# EAGLE design module (EAGLE 9.0.1)
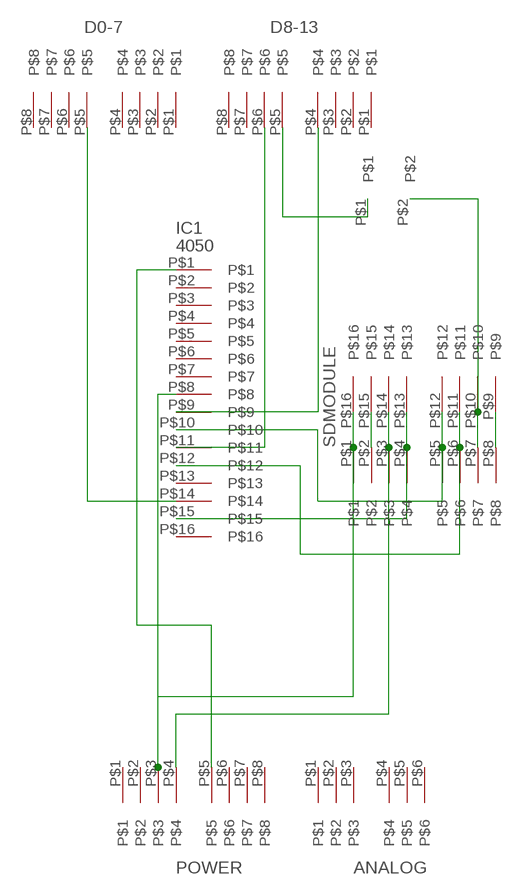
[diagram p0: schematic, sheet 1]

## Parts
ANALOG  PINPLUG6PINPLUG6  [PINPLUG6]
D0-7  PINPLUG8PINPLUG8  [PINPLUG8]
D8-13  PINPLUG8PINPLUG8  [PINPLUG8]
IC1  4050  ICMOUNT16ICMOUNT16  [ICMOUNT16]
POWER  PINPLUG8PINPLUG8  [PINPLUG8]
SDMODULE  PINPLUG8X2PINPLUG8X2  [PINPLUG8X2]
U$1  SHORTSHORT5  [SHORT5]

## Nets
N$1: IC1.P$1 POWER.P$5
N$4: D0-7.P$5 IC1.P$14
N$11: IC1.P$12 SDMODULE.P$6 SDMODULE.P$11
N$12: SDMODULE.P$7 SDMODULE.P$10 U$1.P$2
N$13: D8-13.P$4 IC1.P$9
N$19: SDMODULE.P$8 SDMODULE.P$9
N$20: IC1.P$8 POWER.P$3 SDMODULE.P$1 SDMODULE.P$16
N$22: D8-13.P$5 U$1.P$1
N$32: IC1.P$15 SDMODULE.P$4 SDMODULE.P$13
N$33: IC1.P$10 SDMODULE.P$5 SDMODULE.P$12
N$34: D8-13.P$6 IC1.P$11
N$36: SDMODULE.P$2 SDMODULE.P$15
N$39: POWER.P$4 SDMODULE.P$3 SDMODULE.P$14
Unconnected: ANALOG.P$1 ANALOG.P$2 ANALOG.P$3 ANALOG.P$4 ANALOG.P$5 ANALOG.P$6 D0-7.P$1 D0-7.P$2 D0-7.P$3 D0-7.P$4 D0-7.P$6 D0-7.P$7 D0-7.P$8 D8-13.P$1 D8-13.P$2 D8-13.P$3 D8-13.P$7 D8-13.P$8 IC1.P$2 IC1.P$3 IC1.P$4 IC1.P$5 IC1.P$6 IC1.P$7 IC1.P$13 IC1.P$16 POWER.P$1 POWER.P$2 POWER.P$6 POWER.P$7 POWER.P$8

## Library data of the parts
ANALOG = simple-parts:PINPLUG6
D0-7 D8-13 POWER = simple-parts:PINPLUG8
IC1 = simple-parts:ICMOUNT16
SDMODULE = simple-parts:PINPLUG8X2
U$1 = simple-parts:SHORT

## Net classes
0 default: width 0.5 mm, clearance 0.3 mm
1 ac: width 1 mm, clearance 1 mm

## Board
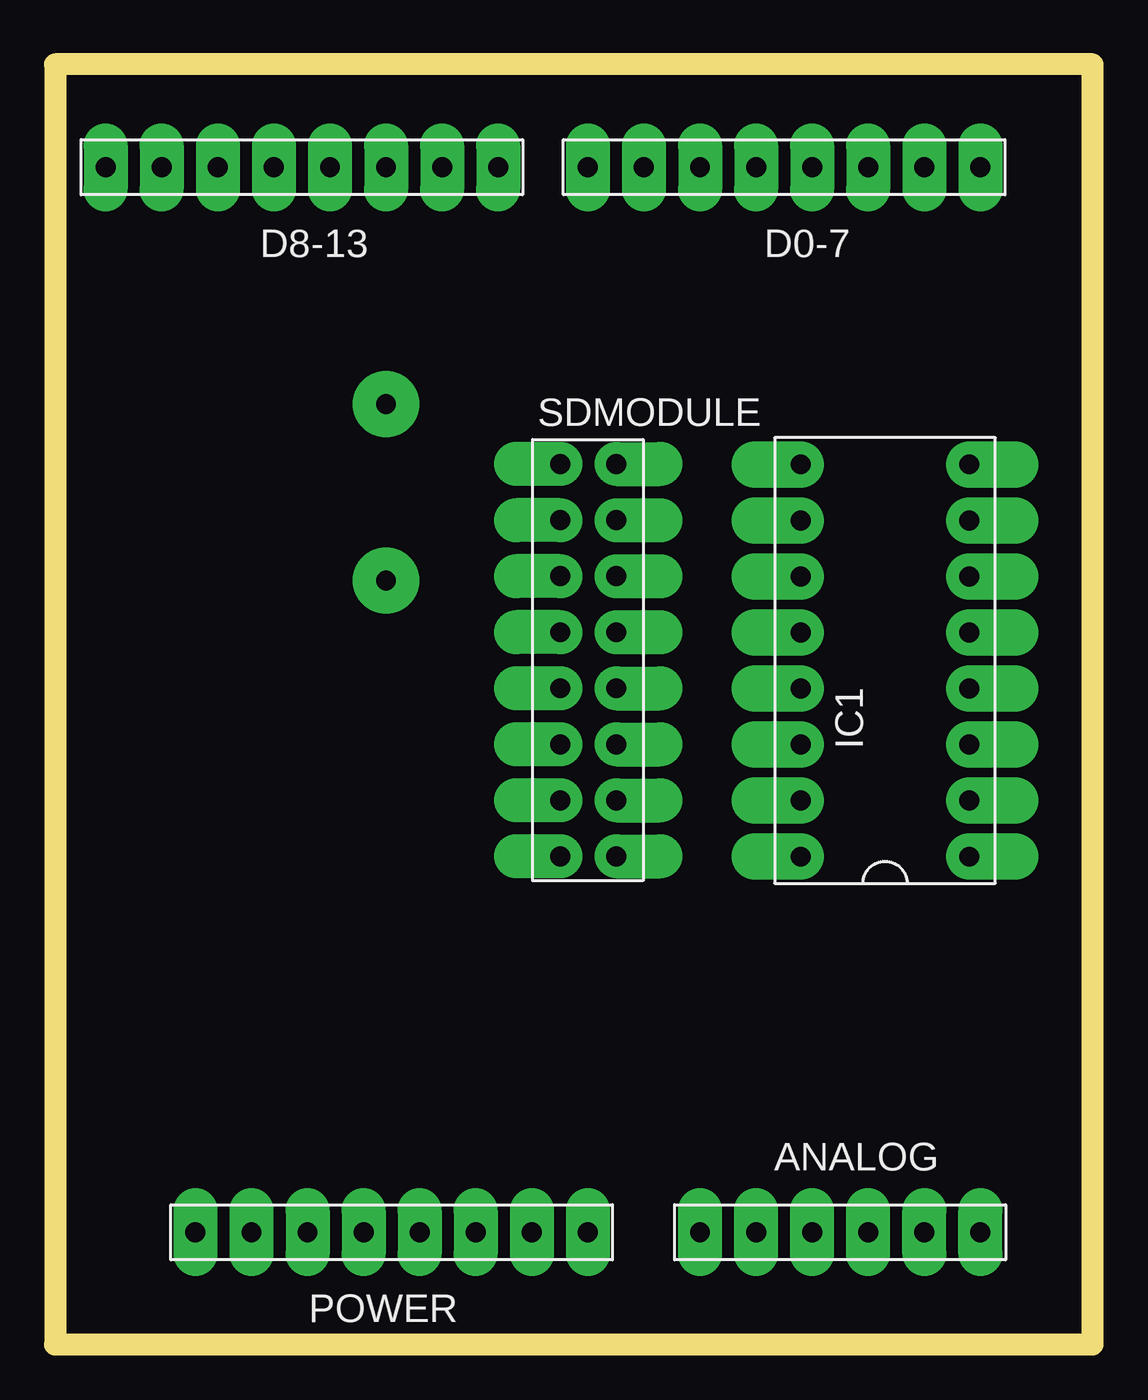
[diagram p1: board, top side]
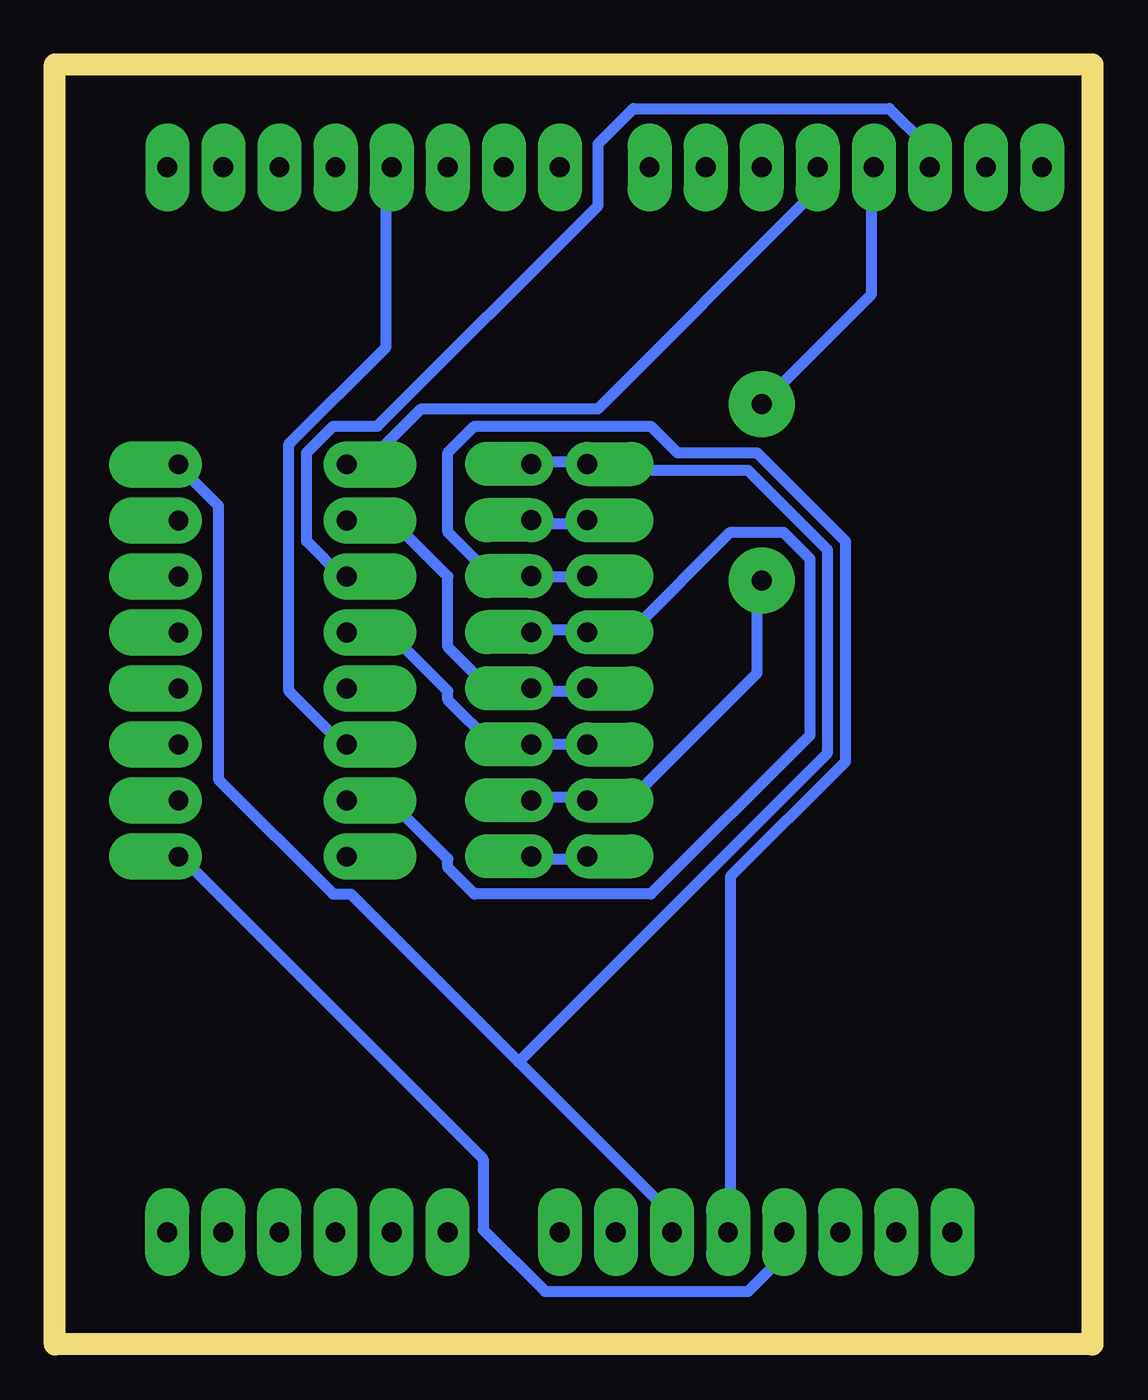
[diagram p2: board, bottom side, seen from below]

Size 46.99 x 58.42 mm. Coordinates in mm from the lower left corner, seen from the top.
Outline: 0,0 46.99,0 46.99,58.42 0,58.42 0,0
Copper layers (1*16): Top 0.035mm / dielectric 1.5mm / Bottom 0.035mm
Design rules "default *": minimum track width 6mil, minimum drill 0.35mm, track to track 0.3mm, track to pad 0.3mm, pad to pad 0.3mm, via to via 0.4mm, smd to smd 6mil, copper to edge 40mil, drill to drill 6mil, minimum pad ring 10mil, minimum via ring 8mil, stop-mask expansion 4mil, vias tented up to drill 0mil, thermal gap 10mil
Milling: 4 lines

### Footprints (pad centres in the part's own frame; a part is rotated, then mirrored left to right if it is on the bottom)
PINPLUG6 = drill 0.9 pad 2 long: P$1 -6.35,0; P$2 -3.81,0; P$3 -1.27,0; P$4 1.27,0; P$5 3.81,0; P$6 6.35,0
PINPLUG8 = drill 0.9 pad 2 long: P$1 -8.89,0; P$2 -6.35,0; P$3 -3.81,0; P$4 -1.27,0; P$5 1.27,0; P$6 3.81,0; P$7 6.35,0; P$8 8.89,0
ICMOUNT16 = drill 0.9 pad 2.1 offset: P$1 -8.89,-3.81; P$2 -6.35,-3.81; P$3 -3.81,-3.81; P$4 -1.27,-3.81; P$5 1.27,-3.81; P$6 3.81,-3.81; P$7 6.35,-3.81; P$8 8.89,-3.81; P$9 8.89,3.81; P$10 6.35,3.81; P$11 3.81,3.81; P$12 1.27,3.81; P$13 -1.27,3.81; P$14 -3.81,3.81; P$15 -6.35,3.81; P$16 -8.89,3.81
PINPLUG8X2 = drill 0.9 pad 2 offset: P$1 -8.89,-1.25; P$2 -6.35,-1.25; P$3 -3.81,-1.25; P$4 -1.27,-1.25; P$5 1.27,-1.25; P$6 3.81,-1.25; P$7 6.35,-1.25; P$8 8.89,-1.25; P$9 8.89,1.29; P$10 6.35,1.29; P$11 3.81,1.29; P$12 1.27,1.29; P$13 -1.27,1.29; P$14 -3.81,1.29; P$15 -6.35,1.29; P$16 -8.89,1.29
SHORT5 = drill 0.9 pad 3: P$1 -4,0; P$2 4,0

### Placement (x,y rotation side)
ANALOG  35.56,5.08 0 top
D0-7  33.02,53.34 180 top
D8-13  11.18,53.34 180 top
IC1  37.59,30.99 90 top
POWER  15.24,5.08 180 top
SDMODULE  24.13,31 270 top
U$1  14.99,38.61 270 top

### Tracks (layer width: path | path; a pad name or v marks a point on that pad's centre or on a via)
N$1
  Bottom 0.5: POWER.P$5 14,4.8 14,4 15.6,2.4 24.8,2.4 27.6,5.2 27.6,8.4 41.2,22 IC1.P$1
N$4
  Bottom 0.5: D0-7.P$5 32,53.2 32,45.2 36.4,40.8 36.4,29.6 34,27.2 IC1.P$14
N$11
  Bottom 0.5: SDMODULE.P$6 23.2,27.2 25.2,27.2 SDMODULE.P$11 25.6,27.2 27.2,27.2 29.2,29.2 29.2,29.6 31.6,32 33.6,32 IC1.P$12
N$12
  Bottom 0.5: SDMODULE.P$10 25.2,24.8 23.2,24.8 SDMODULE.P$7 22.8,24.8 20.8,24.8 15.2,30.4 15.2,34.4 U$1.P$2
N$13
  Bottom 0.5: D8-13.P$4 12.8,53.2 12.8,52 22.4,42.4 30.4,42.4 32.8,40 33.6,40 IC1.P$9
N$19
  Bottom 0.5: SDMODULE.P$8 23.2,22 25.2,22 SDMODULE.P$9
N$20
  Bottom 0.5: SDMODULE.P$16 25.2,40 23.2,40 SDMODULE.P$1 22.8,39.6 15.6,39.6 12,36 12,26.8 26,12.8 | 26,12.8 33.6,20.4 34.4,20.4 39.6,25.6 39.6,38 41.2,39.6 IC1.P$8 | 26,12.8 19.2,6 19.2,5.2 POWER.P$3
N$22
  Bottom 0.5: D8-13.P$5 10,53.2 10,47.6 14.8,42.8 U$1.P$1
N$32
  Bottom 0.5: SDMODULE.P$13 25.2,32.4 23.2,32.4 SDMODULE.P$4 22.8,32.4 20.8,32.4 16.4,36.8 14,36.8 12.8,35.6 12.8,27.6 20,20.4 28,20.4 29.2,21.6 29.2,22 31.6,24.4 33.6,24.4 IC1.P$15
N$33
  Bottom 0.5: SDMODULE.P$5 23.2,29.6 25.2,29.6 SDMODULE.P$12 25.6,30 27.6,30 29.2,31.6 29.2,34.8 31.6,37.2 33.6,37.2 IC1.P$10
N$34
  Bottom 0.5: D8-13.P$6 7.6,53.6 7.6,54.4 9.2,56 20.8,56 22.4,54.4 22.4,51.6 32.4,41.6 34.4,41.6 35.6,40.4 35.6,36.4 34,34.8 IC1.P$11
N$36
  Bottom 0.5: SDMODULE.P$2 23.2,37.2 25.2,37.2 SDMODULE.P$15
N$39
  Bottom 0.5: POWER.P$4 16.4,5.2 16.4,21.2 11.2,26.4 11.2,36.4 15.2,40.4 18.8,40.4 20,41.6 28,41.6 29.2,40.4 29.2,36.8 27.6,35.2 25.6,35.2 SDMODULE.P$14 25.2,34.8 23.2,34.8 SDMODULE.P$3